# Altium schematic sheet DX-BT24-M-V1.4_SCH_Part_AD.SchDoc
size A4
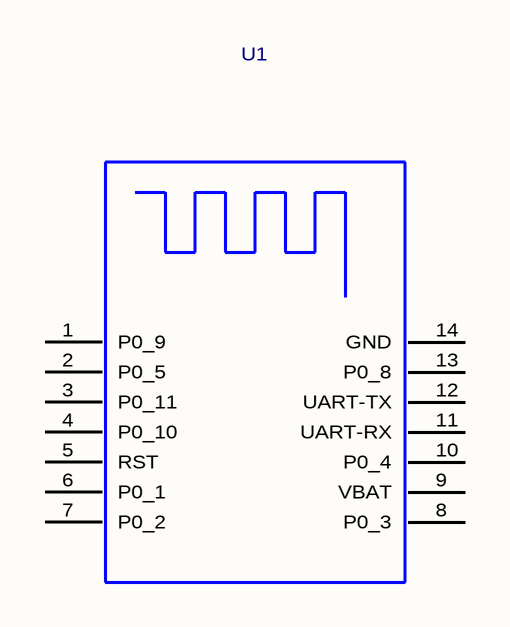
[diagram p0: DX-BT24-M-V1.4_SCH_Part_AD.SchDoc]

## Parts
U1  DX-BT24-M  [DX-BT24-M]  (value not drawn)

## Nets

Not connected (* = marked no-connect by the designer): U1 1(P0_9) 2(P0_5) 3(P0_11) 4(P0_10) 5(RST) 6(P0_1) 7(P0_2) 8(P0_3) 9(VBAT) 10(P0_4) 11(UART-RX) 12(UART-TX) 13(P0_8) 14(GND)

## Library data of the parts
U1 = DX-BT24-M: PCB DECAL: DX-BT24